# Altium project BatteryCompartmentFanController_ThroughHole.PrjPcb
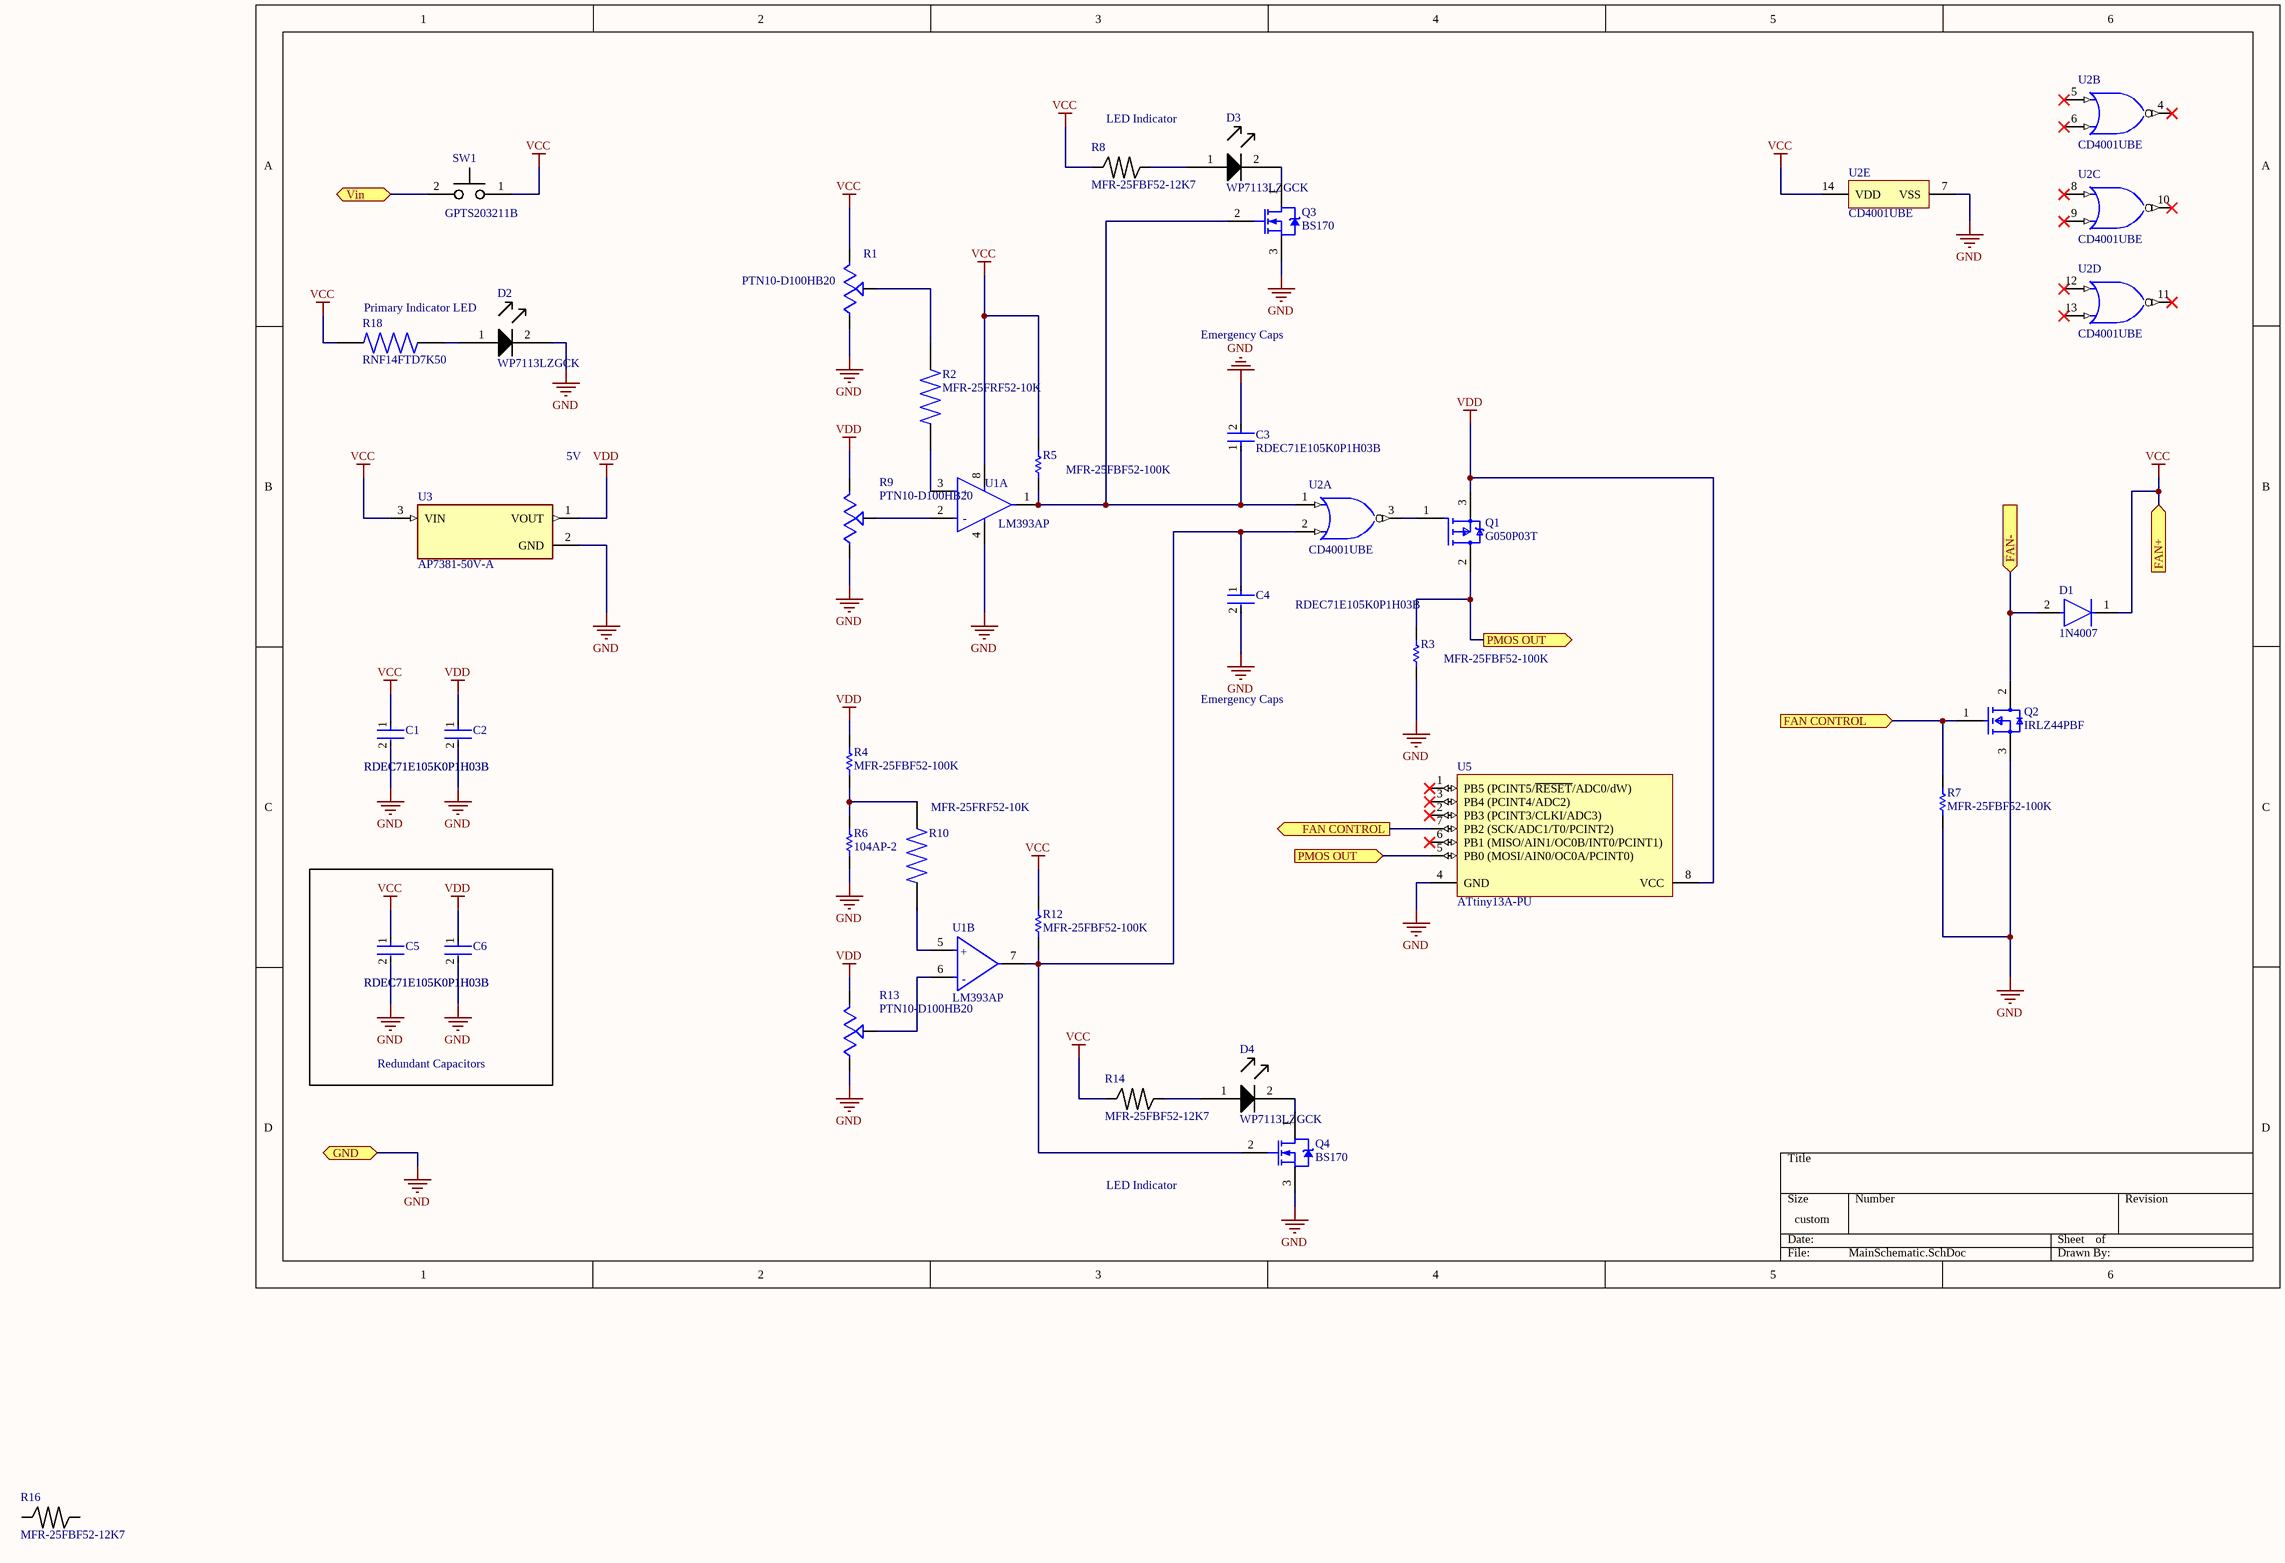
[diagram p0: MainSchematic.SchDoc]
1 sheet, 34 parts. Net scope: flat (ports and power ports of the same name join across sheets).
Board file: PCB1.PcbDoc

## Sheet MainSchematic.SchDoc
size 381 x 241 mm; SheetNumber: 1; SheetTotal: 1

### Parts
C1  RDEC71E105K0P1H03B  [FP-RDE0P1-MFG]
C2  RDEC71E105K0P1H03B  [FP-RDE0P1-MFG]
C3  RDEC71E105K0P1H03B  [FP-RDE0P1-MFG]
C4  RDEC71E105K0P1H03B  [FP-RDE0P1-MFG]
C5  RDEC71E105K0P1H03B  [FP-RDE0P1-MFG]
C6  RDEC71E105K0P1H03B  [FP-RDE0P1-MFG]
D1  1N4007  [FP-1N4007-MFG]
D2  WP7113LZGCK  [WP7113LZGCK]
D3  WP7113LZGCK  [WP7113LZGCK]
D4  WP7113LZGCK  [WP7113LZGCK]
Q1  G050P03T  [FP-340AT-MFG]
Q2  IRLZ44PBF  [FP-PG-TO220-3-MFG]
Q3  BS170  [ONSC-TO-92-3-29-11]
Q4  BS170  [ONSC-TO-92-3-29-11]
R1  PTN10-D100HB20  [TRIM_PTN10-D100HB20]
R2  MFR-25FRF52-10K  [RESAD1100W55L680D260]
R3  MFR-25FBF52-100K  [RESA60-630X240]
R4  MFR-25FBF52-100K  [RESA60-630X240]
R5  MFR-25FBF52-100K  [RESA60-630X240]
R6  104AP-2  [RESA60-630X240]
R7  MFR-25FBF52-100K  [RESA60-630X240]
R8  MFR-25FBF52-12K7  [RESAD1100W55L680D260]
R9  PTN10-D100HB20  [TRIM_PTN10-D100HB20]
R10  MFR-25FRF52-10K  [RESAD1100W55L680D260]
R12  MFR-25FBF52-100K  [RESA60-630X240]
R13  PTN10-D100HB20  [TRIM_PTN10-D100HB20]
R14  MFR-25FBF52-12K7  [RESAD1100W55L680D260]
R16  MFR-25FBF52-12K7  [RESAD1100W55L680D260]
R18  RNF14FTD7K50  [RESAD1100W55L680D260]
SW1  GPTS203211B  [GPTS203211B]
U1  LM393AP  [FP-P0008A-MFG]  (parts A,B of 2)
U2  CD4001UBE  [N0014A]  (parts A,B,C,D,E of 5)
U3  AP7381-50V-A  [TO92254P480H870-3]
U5  ATtiny13A-PU  [8P3]

### Blocks framed on the sheet
Redundant Capacitors: C5 C6

### Ports
FAN CONTROL (in, see MainSchematic[4C]), FAN CONTROL (out, see MainSchematic[5C]), FAN+ (in), FAN- (in), GND (bidir), PMOS OUT (in, see MainSchematic[4B]), PMOS OUT (out, see MainSchematic[4C]), Vin (bidir)

### Nets
GND: C1.2 C2.2 C3.2 C4.2 C5.2 C6.2 D2.2 Q2.3(S) Q3.3(S) Q4.3(S) R1.A(INITIAL) R3.1 R6.1 R7.1 R9.A(INITIAL) R13.A(INITIAL) U1.4(GND) U2.7(VSS) U3.2(GND) U5.4(GND) ; port GND
VCC: C1.1 C5.1 D1.1(C) R1.E(FINAL) R5.2 R8.1 R12.2 R14.1 R18.1 SW1.1 U1.8(VCC) U2.14(VDD) U3.3(VIN) ; port FAN+
VDD: C2.1 C6.1 Q1.3(S) R4.2 R9.E(FINAL) R13.E(FINAL) U3.1(VOUT) U5.8(VCC)
NetC3_1: C3.1 Q3.2(G) R5.1 U1.1(1OUT) U2.1(A)
NetC4_1: C4.1 Q4.2(G) R12.1 U1.7(2OUT) U2.2(B)
NetD1_2: D1.2(A) Q2.2(D) ; port FAN-
NetD2_1: D2.1 R18.2
NetD3_1: D3.1 R8.2
NetD3_2: D3.2 Q3.1(D)
NetD4_1: D4.1 R14.2
NetD4_2: D4.2 Q4.1(D)
NetQ1_1: Q1.1(G) U2.3(J)
NetQ1_2: Q1.2(D) R3.2 U5.5(PB0_(MOSI/AIN0/OC0A/PCINT0)) ; port PMOS OUT
NetQ2_1: Q2.1(G) R7.2 U5.7(PB2_(SCK/ADC1/T0/PCINT2)) ; port FAN CONTROL
NetR1_S: R1.S(WIPER) R2.1
NetR2_2: R2.2 U1.3(1IN+)
NetR4_1: R4.1 R6.2 R10.1
NetR9_S: R9.S(WIPER) U1.2(1IN-)
NetR10_2: R10.2 U1.5(2IN+)
NetR13_S: R13.S(WIPER) U1.6(2IN-)
NetSW1_2: SW1.2 ; port Vin

Not connected (* = marked no-connect by the designer): R16 1 2; U2 4(K)* 5(C)* 6(D)* 8(E)* 9(F)* 10(L)* 11(M)* 12(G)* 13(H)*; U5 1(PB5_(PCINT5/~{RESET}/ADC0/dW))* 2(PB3_(PCINT3/CLKI/ADC3))* 3(PB4_(PCINT4/ADC2))* 6(PB1_(MISO/AIN1/OC0B/INT0/PCINT1))*

### Notes on the sheet
- LED Indicator
- Primary Indicator LED
- Emergency Caps
- 5V
- (in symbol CMP-04896-000062-1, part A) +; -
- (in symbol CMP-04896-000062-1, part B) +; -

### Library data of the parts
C1-C6 = CMP-06035-016937-1: Ceramic Capacitor 1uF ±10% 25V X7S Radial; Lead Diameter: 0.5mm; Lead/Base Style: Kinked; Case/Package: Radial; Mount: Through Hole; Packaging: Bulk; Height - Seated (Max): 0.236inch; Lead Pitch: 0.098inch; Voltage Rating (DC): 25V; Capacitance: 1uF; Length: 3.6mm; Min Operating Temperature: -55°C; Termination: Radial; Width: 0.098inch; Package Quantity: 500; Max Operating Temperature: 125°C; Voltage Rating: 25V; Dielectric: X7S; Tolerance: 10%; Resistor Type: Ceramic; Height: 3.5mm
D1 = CMP-123542-000001-1: Rectifier diode 1000 V 1 A DO-41, ,; Manufacturer: Diotec; Max Surge Forward Current: 27A; Forward Current: 1A; Max Junction Temp: +175°C; Reverse Voltage: 1000V; Value: 15pF; Peak Reverse Current: 5uA; Category: Diode; Temperature Range Low: -50°C; Automotive: No; Temperature: -50°C to +175°C; Lead Free: Yes; ComponentLink2Description: Datasheet; Max Repetitive Reverse Voltage: 1000V; ComponentLink2URL: https://datasheet.octopart.com/1N4007-Diotec-datasheet-62346875.pdf; Manufacturer Part Number: 1N4007; Device Class L3: Rectifier Diodes; Height: 2.8mm; Octopart: https://octopart.com/1n4007-diotec-4040411; Package: 1N4007; Temperature Range High: +175°C; Device Class L1: Discrete Semiconductors; Device Class L2: Diodes; RoHS: TRUE; Capacitance: 15pF; Ipc Land Pattern Name: DIOAD888W100L520D280
D2-D4 = WP7113LZGCK: Green 525nm LED Indication - Discrete 2.65V Radial
Q1 = CMP-00278-84330911-1: P-30V,-85A,RD(MAX)<5M@-10V,VTH-1; Manufacturer Lifecycle Status: OBSOLETE; Gate to Source Voltage (Vgs): 8V; Turn-On Delay Time: 15ns; Continuous Drain Current (ID): 24A; Resistance: 50mΩ; Drain to Source Breakdown Voltage: -20V; Drain to Source Voltage (Vdss): 20V; Element Configuration: Single; Current Rating: -24A; Rise Time: 27ns; Threshold Voltage: -700mV; Number of Elements: 1; Input Capacitance: 1.59nF; Fall Time: 70ns; Max Power Dissipation: 60W; Turn-Off Delay Time: 120ns; Drain to Source Resistance: 5mΩ; Max Operating Temperature: 175°C; Number of Pins: 3; Min Operating Temperature: -55°C; NexarPartId: 84330911; Lead Free: Lead Free; RoHS: Compliant; Schedule B: 8541290080; Voltage Rating (DC): -20V; Weight: 1.8g; Mount: Through Hole; Radiation Hardening: No; Rds On Max: 50mΩ; Length: 10.67mm; Lifecycle Status: Obsolete; Width: 4.7mm; REACH SVHC: No SVHC; Case/Package: TO-220AB; Height: 16.3mm; Power Dissipation: 60W
Q2 = CMP-32901-000590-1: MOSFET N-CH 60V 50A TO220AB; Continuous Drain Current (ID): 95A; Rds On Max: 5.9mR; Max Power Dissipation: 125W; Input Capacitance: 4.01nF; Threshold Voltage: 3.7V; Case/Package: TO-220; Min Operating Temperature: -55°C; Mount: Through Hole; Number of Pins: 3; Lead Free: Lead Free; REACH SVHC: No SVHC; Max Operating Temperature: 175°C; Drain to Source Voltage (Vdss): 60V; Packaging: Rail/Tube; Halogen Free: Halogen Free; Max Dual Supply Voltage: 60V
Q3 Q4 = CMP-1058-00929-1: Small Signal MOSFET, 500 mA, 60 V, N-Channel, 3-Pin TO-92, Bulk Box; Manufacturer: On Semiconductor; VGS Max (V): 20; Configuration: Single; PD Max (W): 0.35; VGS(th) Max (V): 3; ID Max (A): 0.5; V(BR)DSS Min (V): 60; Channel Polarity: N Channel; PackageDescription: 3-Pin Transistor Outline, Body 4.825 x 3.685 mm, Pitch 1.27 mm; Package Type: TO-92; ComponentLink1Description: Manufacturer URL; ComponentLink1URL: http://www.onsemi.com/; DatasheetVersion: Rev. 6; ComponentLink3Description: Package Specification; PartNumber: BS170; ComponentLink2URL: http://www.onsemi.com/pub_link/Collateral/BS170-D.PDF; PackageVersion: Rev. AM; Mounting Technology: Through Hole; PackageReference: TO-92-3-29-11_AM_SL; ComponentLink2Description: Datasheet; ComponentLink3URL: http://www.onsemi.cn/pub_link/Collateral/2N6426-D.PDF; Packing: Bulk Box
R1 R9 R13 = PTN10-D100HB20: 10 mm, 1 MÎ©, Linear, Through Hole, Vertical, Shaftless Hexagonal Trimmer Potentiometer; MF: CUI Devices; SnapEDA_Link: https://www.snapeda.com/parts/PTN10-D100HB20/CUI+Devices/view-part/?ref=snap; Package: None; Value: *; CUI_purchase_URL: https://www.cuidevices.com/product/motion-and-control/potentiometers/trimmer-potentiometers/ptn10-d100hb20?utm_source=snapeda.com&utm_medium=referral&utm_campaign=snapedaBOM; MP: PTN10-D100HB20; Check_prices: https://www.snapeda.com/parts/PTN10-D100HB20/CUI+Devices/view-part/?ref=eda
R2 R10 R18 = MFR-25FRF52-10K: RES 280K OHM 1/4W 1% AXIAL; Package: None; Price: None; Value: *; MP: MFR-25FRF52-10K; Availability: Unavailable
R3-R5 R7 R12 = CMP-1659-00073-1: Axial Resistor, 100 KOhm, +/- 1%, 0.25 W, -55 to 155 degC, 2-Pin THD, RoHS, Bulk; Voltage Rating: 250 V; Power Rating: 250 mW; Resistance: 475 Ohm; PackageDescription: 2-Pin Axial Lead, Dia 2.4 mm, Body Length 6.3 mm; PackageReference: MFR-25; Length: 0.248 inch; ComponentLink2Description: Datasheet; Packaging: Bulk; DatasheetVersion: Apr-13; Package Quantity: 200; Min Operating Temperature: -55 degC; ComponentLink2URL: http://www.yageo.com/documents/recent/Yageo%20LR_MFR_2013.pdf; RoHSCompliant: true; ComponentLink1URL: http://www.yageo.com/; Tolerance: 1%; Case\Package: Axial; Mount: Through Hole; ComponentLink1Description: Manufacturer URL; Max Operating Temperature: 155 degC
R6 = CMP-1659-00073-1: NTC THERMISTORS 100KOHM 0.5%; Voltage Rating: 250 V; Power Rating: 250 mW; Resistance: 475 Ohm; Tolerance: 1%; Case\Package: Axial; PackageDescription: 2-Pin Axial Lead, Dia 2.4 mm, Body Length 6.3 mm; PackageReference: MFR-25; Length: 0.248 inch; ComponentLink2Description: Datasheet; Packaging: Bulk; DatasheetVersion: Apr-13; Package Quantity: 200; Min Operating Temperature: -55 degC; ComponentLink2URL: http://www.yageo.com/documents/recent/Yageo%20LR_MFR_2013.pdf; RoHSCompliant: true; ComponentLink1URL: http://www.yageo.com/; Mount: Through Hole; ComponentLink1Description: Manufacturer URL; Max Operating Temperature: 155 degC
R8 R14 R16 = MFR-25FBF52-12K7: RES 12.7K OHM 1% 1/4W AXIAL
SW1 = GPTS203211B: Pushbutton Switch SPST Standard Through Hole
U1 = CMP-04896-000062-1: IC DUAL DIFF COMPARATOR 8-DIP; Voltage Gain: 106.02dB; Response Time: 0.3us; Nominal Supply Current: 1mA; Max Input Current: 250nA; Max Supply Current: 500uA; Output Current per Channel: 6mA; Max Dual Supply Voltage: 18V; Output Current: 20mA; Input Offset Voltage (Vos): 2mV; Output Type: TTL; Number of Elements: 2; Min Supply Voltage: 2V; Max Supply Voltage: 30V; Min Dual Supply Voltage: 1V; Quiescent Current: 2.5mA; Mount: Through Hole; REACH SVHC: No SVHC; RoHS Compliant: Yes; Max Operating Temperature: 70°C; Packaging: Rail/Tube; Case/Package: PDIP; Number of Pins: 8; Radiation Hardening: No; Contact Plating: Gold; Weight: 0.015535oz; Lead Free: Lead Free; Number of Channels: 2; Min Operating Temperature: 0°C; Input Bias Current: 250nA; Package Quantity: 50; Type: General Purpose
U2 = CMP-0806-00187-3: CMOS Quad 2-Input NOR Gate, N0014A, TUBE; Manufacturer: Texas Instruments; VCC(Max)(V): 18; ICC @ Nom Voltage(Max)(mA): 0.015; Output Drive (IOL/IOH)(Max)(mA): 1.5/-1.5; tpd @ Nom Voltage(Max)(ns): 60; Rating: Catalog; Voltage(Nom)(V): 10; VCC(Min)(V): 3; Bits(#): 4; F @ Nom Voltage(Max)(Mhz): 8; Input Type: CMOS; Code_JEDEC: MS-001; PackageReference: N0014A; Output Type: CMOS; DatasheetVersion: SCHS016C; Operating Temperature Range(C): -55 to 125; PackageVersion: http://www.ti.com/lit/ml/mpdi002c/mpdi002c.pdf; Generic Part Number: CD4001UB
U3 = AP7381-50V-A: Linear Voltage Regulator IC Positive Fixed 1 Output 150mA TO-92; MF: Diodes Inc.; Value: *; SnapEDA_Link: https://www.snapeda.com/parts/AP7381-50V-A/Diodes%20Inc./view-part/2887105/?ref=snap; Check_prices: https://www.snapeda.com/parts/AP7381-50V-A/Diodes%20Inc./view-part/2887105/?ref=eda; MP: AP7381-50V-A; Package: TO-92 Diodes Inc.; Digi-Key_Part_Number: AP7381-50V-ADICT-ND; Purchase-URL: https://pricing.snapeda.com/search/part/AP7381-50V-A/?ref=eda
U5 = CMP-0093-00049-2: 8-bit AVR Microcontroller, 1.8-5.5V, 20MHz, 1KB Flash, 64 Bytes EEPROM, 64 Bytes SRAM, 8-pin PDIP, Industrial Grade (-40°C to 85°C), Pb-Free; DatasheetVersion: revE, Jul-2010; RevisionNote: DatasheetVersion updated. URLs added.; PackageDescription: 8-Lead, 0.300" Wide Body, Plastic Dual In-Line Package (PDIP); ComponentLink1URL: http://www.atmel.com/; PackageReference: 8P3; ComponentLink2URL: http://www.atmel.com/dyn/resources/prod_documents/doc8126.pdf; ComponentLink2Description: ATtiny13A Datasheet; ComponentLink3Description: ATtiny13A Summary; ComponentLink3URL: http://www.atmel.com/dyn/resources/prod_documents/8126S.pdf; ComponentLink1Description: Manufacturer URL; Code_JEDEC: MS-001-BA; PackageVersion: revB, Jan-2002